# Altium schematic sheet QCopterMV-Expand2_Sch.SchDoc: QCopterMV-Expand
size 127 x 127 mm; Author: Hom; CompanyName: KitSprout; DrawnBy: Hom; Engineer: Hom; Organization: KitSprout; Revision: A; SheetNumber: 1; SheetTotal: 1; Version: 2.0; LibVersion: 2.7; PageSetup: Record=PageOptions|CenterHorizontal=True|CenterVertical=True|PrintScale=1.00|XCorrection=1.00|YCorrection=1.00|PrintKind=0|BorderSize=5000000|LeftOffset=0|BottomOffset=0|Orientation=2|PaperLength=1000|PaperWidth=1000|Scale=100|PaperSource=7|PrintQuality=-3|MediaType=1|DitherType=10|PrintScaleMode=0|PaperKind=A4|PaperIndex=9
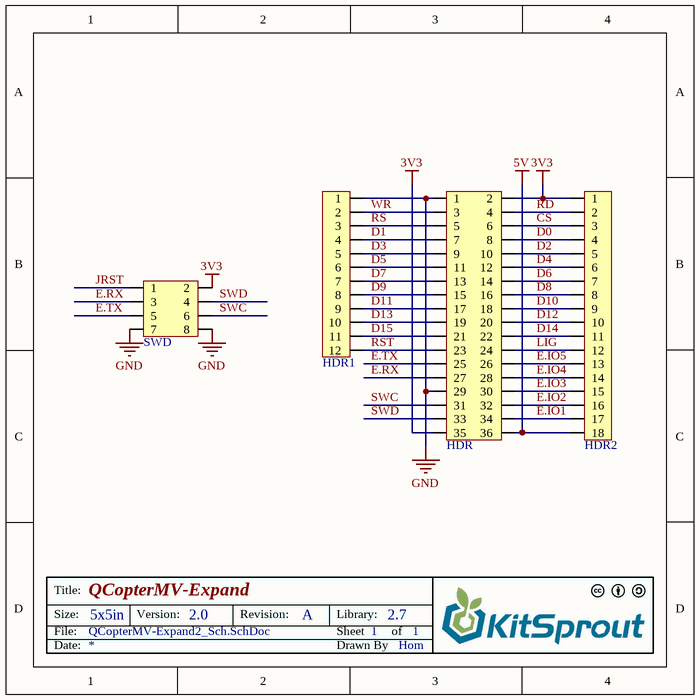
[diagram p0: QCopterMV-Expand2_Sch.SchDoc]

## Parts
HDR  HDR2x18_1.27  [HDR2x18_1.27_180]  (value not drawn)
HDR1  HDR1x12_2.54T  [HDR1X12_2.54_180]  (value not drawn)
HDR2  HDR1x18_2.54  [HDR1X18_2.54_180]  (value not drawn)
SWD  HDR2x4_2.54  [HDR2X4_2.54_180HF]  (value not drawn)

## Nets
3V3: HDR.2 HDR.35 HDR2.1 SWD.2
5V: HDR.36 HDR2.18
GND: HDR.1 HDR.29 HDR1.1 SWD.7 SWD.8
CS: HDR.6 HDR2.3
D0: HDR.8 HDR2.4
D1: HDR.7 HDR1.4
D2: HDR.10 HDR2.5
D3: HDR.9 HDR1.5
D4: HDR.12 HDR2.6
D5: HDR.11 HDR1.6
D6: HDR.14 HDR2.7
D7: HDR.13 HDR1.7
D8: HDR.16 HDR2.8
D9: HDR.15 HDR1.8
D10: HDR.18 HDR2.9
D11: HDR.17 HDR1.9
D12: HDR.20 HDR2.10
D13: HDR.19 HDR1.10
D14: HDR.22 HDR2.11
D15: HDR.21 HDR1.11
E.IO1: HDR.34 HDR2.17
E.IO2: HDR.32 HDR2.16
E.IO3: HDR.30 HDR2.15
E.IO4: HDR.28 HDR2.14
E.IO5: HDR.26 HDR2.13
E.RX: HDR.27 SWD.3
E.TX: HDR.25 SWD.5
JRST: SWD.1
LIG: HDR.24 HDR2.12
RD: HDR.4 HDR2.2
RS: HDR.5 HDR1.3
RST: HDR.23 HDR1.12
SWC: HDR.31 SWD.6
SWD: HDR.33 SWD.4
WR: HDR.3 HDR1.2

## Notes on the sheet
- Title:
- Size:
- Date:
- File:
- 5x5in
- Version:
- Revision:
- Sheet
- Drawn By
- Library:
- of

## Library data of the parts
HDR = HDR2x18_1.27: Header
HDR1 = HDR1x12_2.54T: Header
HDR2 = HDR1x18_2.54: Header
SWD = HDR2x4_2.54: Header